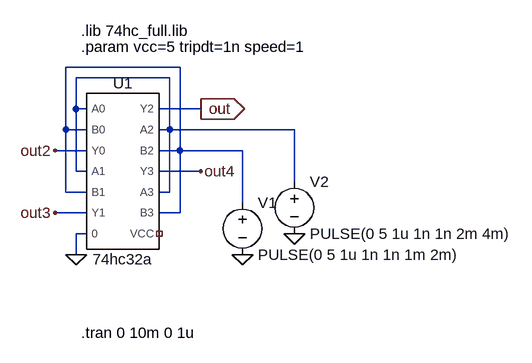
[diagram p0: schematic test32.asc]
test32.asc, the LTspice schematic file:
Version 4
SHEET 1 928 740
WIRE 400 192 224 192
WIRE 384 208 240 208
WIRE 240 256 240 208
WIRE 256 256 240 256
WIRE 432 256 368 256
WIRE 224 288 224 192
WIRE 256 288 224 288
WIRE 384 288 384 208
WIRE 384 288 368 288
WIRE 576 288 384 288
WIRE 256 320 208 320
WIRE 400 320 400 192
WIRE 400 320 368 320
WIRE 496 320 400 320
WIRE 240 352 240 256
WIRE 256 352 240 352
WIRE 432 352 368 352
WIRE 576 368 576 288
WIRE 224 384 224 288
WIRE 256 384 224 384
WIRE 384 384 384 288
WIRE 384 384 368 384
WIRE 496 400 496 320
WIRE 256 416 208 416
WIRE 400 416 400 320
WIRE 400 416 368 416
WIRE 256 448 240 448
WIRE 240 480 240 448
FLAG 240 480 0
FLAG 432 256 out
IOPIN 432 256 Out
FLAG 496 480 0
FLAG 576 448 0
FLAG 208 320 out2
FLAG 208 416 out3
FLAG 432 352 out4
SYMBOL voltage 496 384 R0
WINDOW 123 0 0 Left 0
WINDOW 39 0 0 Left 0
SYMATTR InstName V1
SYMATTR Value PULSE(0 5 1u 1n 1n 1m 2m)
SYMBOL voltage 576 352 R0
WINDOW 123 0 0 Left 0
WINDOW 39 0 0 Left 0
SYMATTR InstName V2
SYMATTR Value PULSE(0 5 1u 1n 1n 2m 4m)
SYMBOL 74hc32a 304 352 R0
SYMATTR InstName U1
TEXT 248 136 Left 2 !.lib 74hc_full.lib
TEXT 248 160 Left 2 !.param vcc=5 tripdt=1n speed=1
TEXT 248 600 Left 2 !.tran 0 10m 0 1u

The netlist it stands for:
* test32.asc
V1 N001 0 PULSE(0 5 1u 1n 1n 1m 2m)
V2 N002 0 PULSE(0 5 1u 1n 1n 2m 4m)
XU1 N002 N001 out2 N002 N001 out3 0 out N002 N001 out4 N002 N001 NC_01 74hc32a  ; pins A0 B0 Y0 A1 B1 Y1 0 Y2 A2 B2 Y3 A3 B3 VCC
.lib 74hc_full.lib
.param vcc=5 tripdt=1n speed=1
.tran 0 10m 0 1u
.lib mysub\74hc_full.lib
.backanno
.end